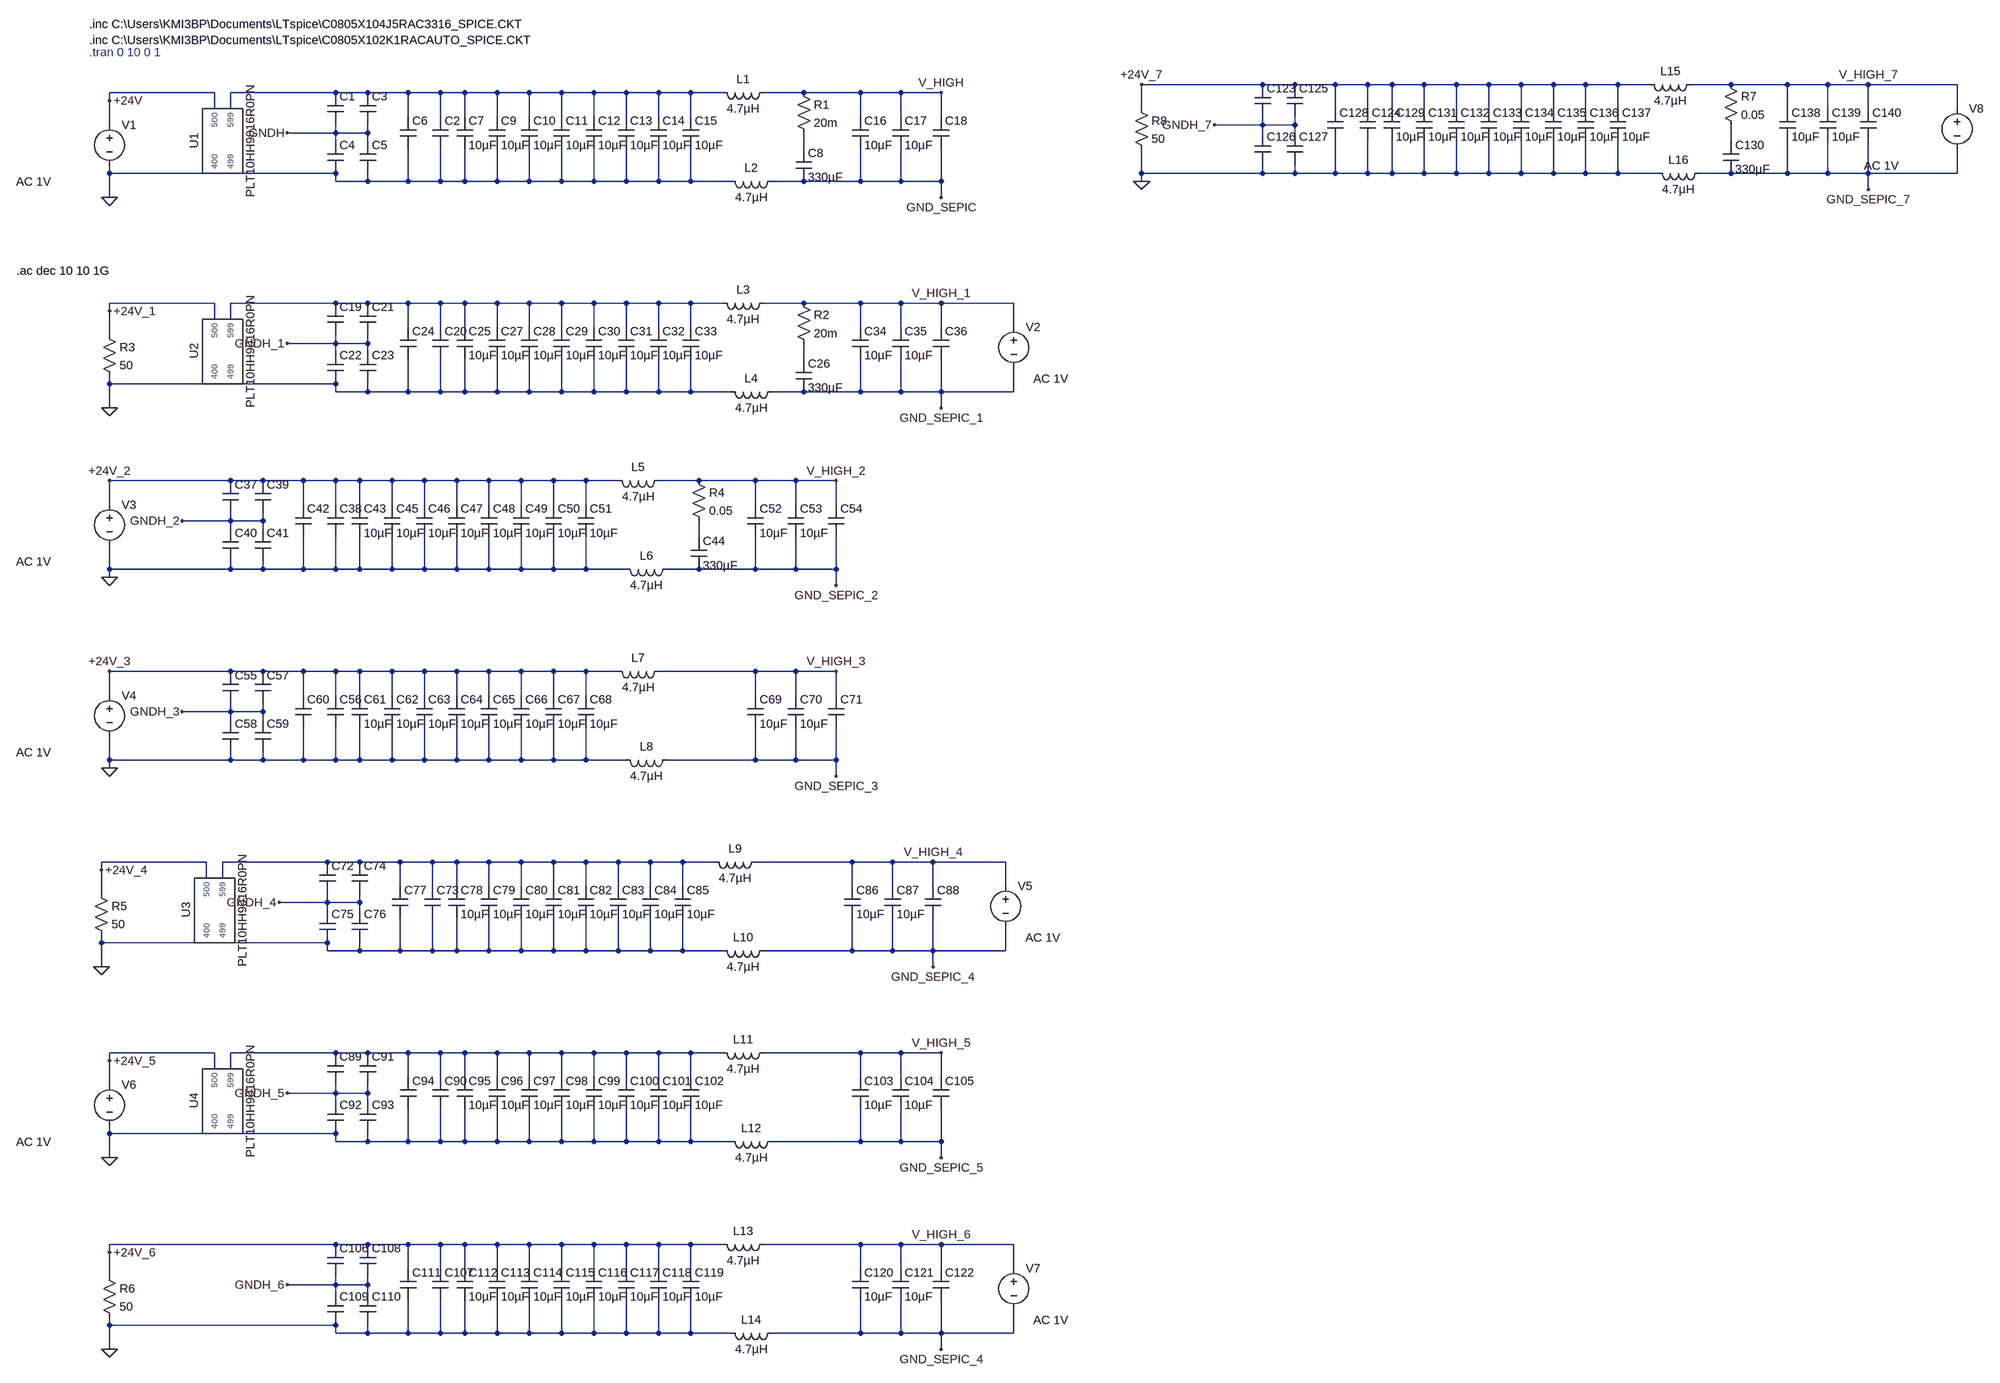
[diagram p0: schematic Draft4.asc]
Draft4.asc, the LTspice schematic file:
Version 4
SHEET 1 2840 2916
WIRE 1408 -64 1168 -64
WIRE 1472 -64 1408 -64
WIRE 1552 -64 1472 -64
WIRE 1616 -64 1552 -64
WIRE 1664 -64 1616 -64
WIRE 1728 -64 1664 -64
WIRE 1792 -64 1728 -64
WIRE 1856 -64 1792 -64
WIRE 1920 -64 1856 -64
WIRE 1984 -64 1920 -64
WIRE 2048 -64 1984 -64
WIRE 2112 -64 2048 -64
WIRE 2176 -64 2112 -64
WIRE 2336 -64 2256 -64
WIRE 2448 -64 2336 -64
WIRE 2528 -64 2448 -64
WIRE 2608 -64 2528 -64
WIRE 2784 -64 2608 -64
WIRE -976 -48 -1184 -48
WIRE -736 -48 -944 -48
WIRE -672 -48 -736 -48
WIRE -592 -48 -672 -48
WIRE -528 -48 -592 -48
WIRE -480 -48 -528 -48
WIRE -416 -48 -480 -48
WIRE -352 -48 -416 -48
WIRE -288 -48 -352 -48
WIRE -224 -48 -288 -48
WIRE -160 -48 -224 -48
WIRE -96 -48 -160 -48
WIRE -32 -48 -96 -48
WIRE 32 -48 -32 -48
WIRE 192 -48 112 -48
WIRE 304 -48 192 -48
WIRE 384 -48 304 -48
WIRE 464 -48 384 -48
WIRE -1184 -32 -1184 -48
WIRE -976 -16 -976 -48
WIRE -944 -16 -944 -48
WIRE 1168 -16 1168 -64
WIRE 1552 -16 1552 -64
WIRE 1616 -16 1616 -64
WIRE 1664 -16 1664 -64
WIRE 1728 -16 1728 -64
WIRE 1792 -16 1792 -64
WIRE 1856 -16 1856 -64
WIRE 1920 -16 1920 -64
WIRE 1984 -16 1984 -64
WIRE 2048 -16 2048 -64
WIRE 2112 -16 2112 -64
WIRE 2448 -16 2448 -64
WIRE 2528 -16 2528 -64
WIRE 2608 -16 2608 -64
WIRE 2784 -16 2784 -64
WIRE -592 0 -592 -48
WIRE -528 0 -528 -48
WIRE -480 0 -480 -48
WIRE -416 0 -416 -48
WIRE -352 0 -352 -48
WIRE -288 0 -288 -48
WIRE -224 0 -224 -48
WIRE -160 0 -160 -48
WIRE -96 0 -96 -48
WIRE -32 0 -32 -48
WIRE 304 0 304 -48
WIRE 384 0 384 -48
WIRE 464 0 464 -48
WIRE -1184 16 -1184 -32
WIRE 1408 16 1408 0
WIRE 1408 16 1312 16
WIRE 1472 16 1472 0
WIRE 1472 16 1408 16
WIRE -736 32 -736 16
WIRE -736 32 -832 32
WIRE -672 32 -672 16
WIRE -672 32 -736 32
WIRE 1408 32 1408 16
WIRE 1472 32 1472 16
WIRE -736 48 -736 32
WIRE -672 48 -672 32
WIRE 2336 48 2336 16
WIRE 192 64 192 32
WIRE -1184 112 -1184 96
WIRE -976 112 -1184 112
WIRE -736 112 -944 112
WIRE 1168 112 1168 64
WIRE 1408 112 1408 96
WIRE 1408 112 1168 112
WIRE 1472 112 1472 96
WIRE 1472 112 1408 112
WIRE 1552 112 1552 48
WIRE 1552 112 1472 112
WIRE 1616 112 1616 48
WIRE 1616 112 1552 112
WIRE 1664 112 1664 48
WIRE 1664 112 1616 112
WIRE 1728 112 1728 48
WIRE 1728 112 1664 112
WIRE 1792 112 1792 48
WIRE 1792 112 1728 112
WIRE 1856 112 1856 48
WIRE 1856 112 1792 112
WIRE 1920 112 1920 48
WIRE 1920 112 1856 112
WIRE 1984 112 1984 48
WIRE 1984 112 1920 112
WIRE 2048 112 2048 48
WIRE 2048 112 1984 112
WIRE 2112 112 2112 48
WIRE 2112 112 2048 112
WIRE 2192 112 2112 112
WIRE 2336 112 2272 112
WIRE 2448 112 2448 48
WIRE 2448 112 2336 112
WIRE 2528 112 2528 48
WIRE 2528 112 2448 112
WIRE 2608 112 2608 48
WIRE 2608 112 2528 112
WIRE 2784 112 2784 64
WIRE 2784 112 2608 112
WIRE -736 128 -736 112
WIRE -672 128 -672 112
WIRE -672 128 -736 128
WIRE -592 128 -592 64
WIRE -592 128 -672 128
WIRE -528 128 -528 64
WIRE -528 128 -592 128
WIRE -480 128 -480 64
WIRE -480 128 -528 128
WIRE -416 128 -416 64
WIRE -416 128 -480 128
WIRE -352 128 -352 64
WIRE -352 128 -416 128
WIRE -288 128 -288 64
WIRE -288 128 -352 128
WIRE -224 128 -224 64
WIRE -224 128 -288 128
WIRE -160 128 -160 64
WIRE -160 128 -224 128
WIRE -96 128 -96 64
WIRE -96 128 -160 128
WIRE -32 128 -32 64
WIRE -32 128 -96 128
WIRE 48 128 -32 128
WIRE 192 128 128 128
WIRE 304 128 304 64
WIRE 304 128 192 128
WIRE 384 128 384 64
WIRE 384 128 304 128
WIRE 464 128 464 64
WIRE 464 128 384 128
WIRE 1168 128 1168 112
WIRE 2608 144 2608 112
WIRE -1184 160 -1184 112
WIRE 464 160 464 128
WIRE -976 416 -1184 416
WIRE -736 416 -944 416
WIRE -672 416 -736 416
WIRE -592 416 -672 416
WIRE -528 416 -592 416
WIRE -480 416 -528 416
WIRE -416 416 -480 416
WIRE -352 416 -416 416
WIRE -288 416 -352 416
WIRE -224 416 -288 416
WIRE -160 416 -224 416
WIRE -96 416 -160 416
WIRE -32 416 -96 416
WIRE 32 416 -32 416
WIRE 192 416 112 416
WIRE 304 416 192 416
WIRE 384 416 304 416
WIRE 464 416 384 416
WIRE 608 416 464 416
WIRE -1184 432 -1184 416
WIRE -976 448 -976 416
WIRE -944 448 -944 416
WIRE -592 464 -592 416
WIRE -528 464 -528 416
WIRE -480 464 -480 416
WIRE -416 464 -416 416
WIRE -352 464 -352 416
WIRE -288 464 -288 416
WIRE -224 464 -224 416
WIRE -160 464 -160 416
WIRE -96 464 -96 416
WIRE -32 464 -32 416
WIRE 304 464 304 416
WIRE 384 464 384 416
WIRE 464 464 464 416
WIRE 608 464 608 416
WIRE -1184 480 -1184 432
WIRE -736 496 -736 480
WIRE -736 496 -832 496
WIRE -672 496 -672 480
WIRE -672 496 -736 496
WIRE -736 512 -736 496
WIRE -672 512 -672 496
WIRE 192 528 192 496
WIRE -1184 576 -1184 560
WIRE -976 576 -1184 576
WIRE -736 576 -944 576
WIRE -736 592 -736 576
WIRE -672 592 -672 576
WIRE -672 592 -736 592
WIRE -592 592 -592 528
WIRE -592 592 -672 592
WIRE -528 592 -528 528
WIRE -528 592 -592 592
WIRE -480 592 -480 528
WIRE -480 592 -528 592
WIRE -416 592 -416 528
WIRE -416 592 -480 592
WIRE -352 592 -352 528
WIRE -352 592 -416 592
WIRE -288 592 -288 528
WIRE -288 592 -352 592
WIRE -224 592 -224 528
WIRE -224 592 -288 592
WIRE -160 592 -160 528
WIRE -160 592 -224 592
WIRE -96 592 -96 528
WIRE -96 592 -160 592
WIRE -32 592 -32 528
WIRE -32 592 -96 592
WIRE 48 592 -32 592
WIRE 192 592 128 592
WIRE 304 592 304 528
WIRE 304 592 192 592
WIRE 384 592 384 528
WIRE 384 592 304 592
WIRE 464 592 464 528
WIRE 464 592 384 592
WIRE 608 592 608 544
WIRE 608 592 464 592
WIRE -1184 624 -1184 576
WIRE 464 624 464 592
WIRE -944 768 -1184 768
WIRE -880 768 -944 768
WIRE -800 768 -880 768
WIRE -736 768 -800 768
WIRE -688 768 -736 768
WIRE -624 768 -688 768
WIRE -560 768 -624 768
WIRE -496 768 -560 768
WIRE -432 768 -496 768
WIRE -368 768 -432 768
WIRE -304 768 -368 768
WIRE -240 768 -304 768
WIRE -176 768 -240 768
WIRE -16 768 -96 768
WIRE 96 768 -16 768
WIRE 176 768 96 768
WIRE 256 768 176 768
WIRE -1184 816 -1184 768
WIRE -800 816 -800 768
WIRE -736 816 -736 768
WIRE -688 816 -688 768
WIRE -624 816 -624 768
WIRE -560 816 -560 768
WIRE -496 816 -496 768
WIRE -432 816 -432 768
WIRE -368 816 -368 768
WIRE -304 816 -304 768
WIRE -240 816 -240 768
WIRE 96 816 96 768
WIRE 176 816 176 768
WIRE 256 816 256 768
WIRE -944 848 -944 832
WIRE -944 848 -1040 848
WIRE -880 848 -880 832
WIRE -880 848 -944 848
WIRE -944 864 -944 848
WIRE -880 864 -880 848
WIRE -16 880 -16 848
WIRE -1184 944 -1184 896
WIRE -944 944 -944 928
WIRE -944 944 -1184 944
WIRE -880 944 -880 928
WIRE -880 944 -944 944
WIRE -800 944 -800 880
WIRE -800 944 -880 944
WIRE -736 944 -736 880
WIRE -736 944 -800 944
WIRE -688 944 -688 880
WIRE -688 944 -736 944
WIRE -624 944 -624 880
WIRE -624 944 -688 944
WIRE -560 944 -560 880
WIRE -560 944 -624 944
WIRE -496 944 -496 880
WIRE -496 944 -560 944
WIRE -432 944 -432 880
WIRE -432 944 -496 944
WIRE -368 944 -368 880
WIRE -368 944 -432 944
WIRE -304 944 -304 880
WIRE -304 944 -368 944
WIRE -240 944 -240 880
WIRE -240 944 -304 944
WIRE -160 944 -240 944
WIRE -16 944 -80 944
WIRE 96 944 96 880
WIRE 96 944 -16 944
WIRE 176 944 176 880
WIRE 176 944 96 944
WIRE 256 944 256 880
WIRE 256 944 176 944
WIRE -1184 960 -1184 944
WIRE 256 976 256 944
WIRE -944 1168 -1184 1168
WIRE -880 1168 -944 1168
WIRE -800 1168 -880 1168
WIRE -736 1168 -800 1168
WIRE -688 1168 -736 1168
WIRE -624 1168 -688 1168
WIRE -560 1168 -624 1168
WIRE -496 1168 -560 1168
WIRE -432 1168 -496 1168
WIRE -368 1168 -432 1168
WIRE -304 1168 -368 1168
WIRE -240 1168 -304 1168
WIRE -176 1168 -240 1168
WIRE 96 1168 -96 1168
WIRE 176 1168 96 1168
WIRE 256 1168 176 1168
WIRE -1184 1216 -1184 1168
WIRE -800 1216 -800 1168
WIRE -736 1216 -736 1168
WIRE -688 1216 -688 1168
WIRE -624 1216 -624 1168
WIRE -560 1216 -560 1168
WIRE -496 1216 -496 1168
WIRE -432 1216 -432 1168
WIRE -368 1216 -368 1168
WIRE -304 1216 -304 1168
WIRE -240 1216 -240 1168
WIRE 96 1216 96 1168
WIRE 176 1216 176 1168
WIRE 256 1216 256 1168
WIRE -944 1248 -944 1232
WIRE -944 1248 -1040 1248
WIRE -880 1248 -880 1232
WIRE -880 1248 -944 1248
WIRE -944 1264 -944 1248
WIRE -880 1264 -880 1248
WIRE -1184 1344 -1184 1296
WIRE -944 1344 -944 1328
WIRE -944 1344 -1184 1344
WIRE -880 1344 -880 1328
WIRE -880 1344 -944 1344
WIRE -800 1344 -800 1280
WIRE -800 1344 -880 1344
WIRE -736 1344 -736 1280
WIRE -736 1344 -800 1344
WIRE -688 1344 -688 1280
WIRE -688 1344 -736 1344
WIRE -624 1344 -624 1280
WIRE -624 1344 -688 1344
WIRE -560 1344 -560 1280
WIRE -560 1344 -624 1344
WIRE -496 1344 -496 1280
WIRE -496 1344 -560 1344
WIRE -432 1344 -432 1280
WIRE -432 1344 -496 1344
WIRE -368 1344 -368 1280
WIRE -368 1344 -432 1344
WIRE -304 1344 -304 1280
WIRE -304 1344 -368 1344
WIRE -240 1344 -240 1280
WIRE -240 1344 -304 1344
WIRE -160 1344 -240 1344
WIRE 96 1344 96 1280
WIRE 96 1344 -80 1344
WIRE 176 1344 176 1280
WIRE 176 1344 96 1344
WIRE 256 1344 256 1280
WIRE 256 1344 176 1344
WIRE -1184 1360 -1184 1344
WIRE 256 1376 256 1344
WIRE -992 1616 -1200 1616
WIRE -752 1616 -960 1616
WIRE -688 1616 -752 1616
WIRE -608 1616 -688 1616
WIRE -544 1616 -608 1616
WIRE -496 1616 -544 1616
WIRE -432 1616 -496 1616
WIRE -368 1616 -432 1616
WIRE -304 1616 -368 1616
WIRE -240 1616 -304 1616
WIRE -176 1616 -240 1616
WIRE -112 1616 -176 1616
WIRE -48 1616 -112 1616
WIRE 16 1616 -48 1616
WIRE 288 1616 96 1616
WIRE 368 1616 288 1616
WIRE 448 1616 368 1616
WIRE 592 1616 448 1616
WIRE -1200 1632 -1200 1616
WIRE -992 1648 -992 1616
WIRE -960 1648 -960 1616
WIRE -608 1664 -608 1616
WIRE -544 1664 -544 1616
WIRE -496 1664 -496 1616
WIRE -432 1664 -432 1616
WIRE -368 1664 -368 1616
WIRE -304 1664 -304 1616
WIRE -240 1664 -240 1616
WIRE -176 1664 -176 1616
WIRE -112 1664 -112 1616
WIRE -48 1664 -48 1616
WIRE 288 1664 288 1616
WIRE 368 1664 368 1616
WIRE 448 1664 448 1616
WIRE 592 1664 592 1616
WIRE -1200 1680 -1200 1632
WIRE -752 1696 -752 1680
WIRE -752 1696 -848 1696
WIRE -688 1696 -688 1680
WIRE -688 1696 -752 1696
WIRE -752 1712 -752 1696
WIRE -688 1712 -688 1696
WIRE -1200 1776 -1200 1760
WIRE -992 1776 -1200 1776
WIRE -752 1776 -960 1776
WIRE -752 1792 -752 1776
WIRE -688 1792 -688 1776
WIRE -688 1792 -752 1792
WIRE -608 1792 -608 1728
WIRE -608 1792 -688 1792
WIRE -544 1792 -544 1728
WIRE -544 1792 -608 1792
WIRE -496 1792 -496 1728
WIRE -496 1792 -544 1792
WIRE -432 1792 -432 1728
WIRE -432 1792 -496 1792
WIRE -368 1792 -368 1728
WIRE -368 1792 -432 1792
WIRE -304 1792 -304 1728
WIRE -304 1792 -368 1792
WIRE -240 1792 -240 1728
WIRE -240 1792 -304 1792
WIRE -176 1792 -176 1728
WIRE -176 1792 -240 1792
WIRE -112 1792 -112 1728
WIRE -112 1792 -176 1792
WIRE -48 1792 -48 1728
WIRE -48 1792 -112 1792
WIRE 32 1792 -48 1792
WIRE 288 1792 288 1728
WIRE 288 1792 112 1792
WIRE 368 1792 368 1728
WIRE 368 1792 288 1792
WIRE 448 1792 448 1728
WIRE 448 1792 368 1792
WIRE 592 1792 592 1744
WIRE 592 1792 448 1792
WIRE -1200 1824 -1200 1776
WIRE 448 1824 448 1792
WIRE -976 2016 -1184 2016
WIRE -736 2016 -944 2016
WIRE -672 2016 -736 2016
WIRE -592 2016 -672 2016
WIRE -528 2016 -592 2016
WIRE -480 2016 -528 2016
WIRE -416 2016 -480 2016
WIRE -352 2016 -416 2016
WIRE -288 2016 -352 2016
WIRE -224 2016 -288 2016
WIRE -160 2016 -224 2016
WIRE -96 2016 -160 2016
WIRE -32 2016 -96 2016
WIRE 32 2016 -32 2016
WIRE 304 2016 112 2016
WIRE 384 2016 304 2016
WIRE 464 2016 384 2016
WIRE -1184 2032 -1184 2016
WIRE -976 2048 -976 2016
WIRE -944 2048 -944 2016
WIRE -592 2064 -592 2016
WIRE -528 2064 -528 2016
WIRE -480 2064 -480 2016
WIRE -416 2064 -416 2016
WIRE -352 2064 -352 2016
WIRE -288 2064 -288 2016
WIRE -224 2064 -224 2016
WIRE -160 2064 -160 2016
WIRE -96 2064 -96 2016
WIRE -32 2064 -32 2016
WIRE 304 2064 304 2016
WIRE 384 2064 384 2016
WIRE 464 2064 464 2016
WIRE -1184 2080 -1184 2032
WIRE -736 2096 -736 2080
WIRE -736 2096 -832 2096
WIRE -672 2096 -672 2080
WIRE -672 2096 -736 2096
WIRE -736 2112 -736 2096
WIRE -672 2112 -672 2096
WIRE -1184 2176 -1184 2160
WIRE -976 2176 -1184 2176
WIRE -736 2176 -944 2176
WIRE -736 2192 -736 2176
WIRE -672 2192 -672 2176
WIRE -672 2192 -736 2192
WIRE -592 2192 -592 2128
WIRE -592 2192 -672 2192
WIRE -528 2192 -528 2128
WIRE -528 2192 -592 2192
WIRE -480 2192 -480 2128
WIRE -480 2192 -528 2192
WIRE -416 2192 -416 2128
WIRE -416 2192 -480 2192
WIRE -352 2192 -352 2128
WIRE -352 2192 -416 2192
WIRE -288 2192 -288 2128
WIRE -288 2192 -352 2192
WIRE -224 2192 -224 2128
WIRE -224 2192 -288 2192
WIRE -160 2192 -160 2128
WIRE -160 2192 -224 2192
WIRE -96 2192 -96 2128
WIRE -96 2192 -160 2192
WIRE -32 2192 -32 2128
WIRE -32 2192 -96 2192
WIRE 48 2192 -32 2192
WIRE 304 2192 304 2128
WIRE 304 2192 128 2192
WIRE 384 2192 384 2128
WIRE 384 2192 304 2192
WIRE 464 2192 464 2128
WIRE 464 2192 384 2192
WIRE -1184 2224 -1184 2176
WIRE 464 2224 464 2192
WIRE -736 2496 -1184 2496
WIRE -672 2496 -736 2496
WIRE -592 2496 -672 2496
WIRE -528 2496 -592 2496
WIRE -480 2496 -528 2496
WIRE -416 2496 -480 2496
WIRE -352 2496 -416 2496
WIRE -288 2496 -352 2496
WIRE -224 2496 -288 2496
WIRE -160 2496 -224 2496
WIRE -96 2496 -160 2496
WIRE -32 2496 -96 2496
WIRE 32 2496 -32 2496
WIRE 304 2496 112 2496
WIRE 384 2496 304 2496
WIRE 464 2496 384 2496
WIRE 608 2496 464 2496
WIRE -1184 2512 -1184 2496
WIRE -592 2544 -592 2496
WIRE -528 2544 -528 2496
WIRE -480 2544 -480 2496
WIRE -416 2544 -416 2496
WIRE -352 2544 -352 2496
WIRE -288 2544 -288 2496
WIRE -224 2544 -224 2496
WIRE -160 2544 -160 2496
WIRE -96 2544 -96 2496
WIRE -32 2544 -32 2496
WIRE 304 2544 304 2496
WIRE 384 2544 384 2496
WIRE 464 2544 464 2496
WIRE 608 2544 608 2496
WIRE -1184 2560 -1184 2512
WIRE -736 2576 -736 2560
WIRE -736 2576 -832 2576
WIRE -672 2576 -672 2560
WIRE -672 2576 -736 2576
WIRE -736 2592 -736 2576
WIRE -672 2592 -672 2576
WIRE -1184 2656 -1184 2640
WIRE -736 2656 -1184 2656
WIRE -736 2672 -736 2656
WIRE -672 2672 -672 2656
WIRE -672 2672 -736 2672
WIRE -592 2672 -592 2608
WIRE -592 2672 -672 2672
WIRE -528 2672 -528 2608
WIRE -528 2672 -592 2672
WIRE -480 2672 -480 2608
WIRE -480 2672 -528 2672
WIRE -416 2672 -416 2608
WIRE -416 2672 -480 2672
WIRE -352 2672 -352 2608
WIRE -352 2672 -416 2672
WIRE -288 2672 -288 2608
WIRE -288 2672 -352 2672
WIRE -224 2672 -224 2608
WIRE -224 2672 -288 2672
WIRE -160 2672 -160 2608
WIRE -160 2672 -224 2672
WIRE -96 2672 -96 2608
WIRE -96 2672 -160 2672
WIRE -32 2672 -32 2608
WIRE -32 2672 -96 2672
WIRE 48 2672 -32 2672
WIRE 304 2672 304 2608
WIRE 304 2672 128 2672
WIRE 384 2672 384 2608
WIRE 384 2672 304 2672
WIRE 464 2672 464 2608
WIRE 464 2672 384 2672
WIRE 608 2672 608 2624
WIRE 608 2672 464 2672
WIRE -1184 2704 -1184 2656
WIRE 464 2704 464 2672
FLAG -1184 160 0
FLAG -1184 -32 +24V
FLAG -832 32 GNDH
FLAG 464 160 GND_SEPIC
FLAG 464 -48 V_HIGH
FLAG -1184 624 0
FLAG -1184 432 +24V_1
FLAG -832 496 GNDH_1
FLAG 464 624 GND_SEPIC_1
FLAG 464 416 V_HIGH_1
FLAG -1040 848 GNDH_2
FLAG -1184 960 0
FLAG 256 976 GND_SEPIC_2
FLAG 256 768 V_HIGH_2
FLAG -1184 768 +24V_2
FLAG -1040 1248 GNDH_3
FLAG -1184 1360 0
FLAG 256 1376 GND_SEPIC_3
FLAG 256 1168 V_HIGH_3
FLAG -1184 1168 +24V_3
FLAG -1200 1824 0
FLAG -1200 1632 +24V_4
FLAG -848 1696 GNDH_4
FLAG 448 1824 GND_SEPIC_4
FLAG 448 1616 V_HIGH_4
FLAG -1184 2224 0
FLAG -1184 2032 +24V_5
FLAG -832 2096 GNDH_5
FLAG 464 2224 GND_SEPIC_5
FLAG 464 2016 V_HIGH_5
FLAG -1184 2704 0
FLAG -1184 2512 +24V_6
FLAG -832 2576 GNDH_6
FLAG 464 2704 GND_SEPIC_4
FLAG 464 2496 V_HIGH_6
FLAG 1312 16 GNDH_7
FLAG 1168 128 0
FLAG 2608 144 GND_SEPIC_7
FLAG 2608 -64 V_HIGH_7
FLAG 1168 -64 +24V_7
SYMBOL PLT10HH9016R0PN -960 48 R270
SYMATTR InstName U1
SYMBOL voltage -1184 0 R0
WINDOW 3 -185 101 Left 2
WINDOW 123 -185 129 Left 2
WINDOW 39 0 0 Left 0
SYMATTR Value ""
SYMATTR Value2 AC 1V
SYMATTR InstName V1
SYMBOL cap -752 -48 R0
WINDOW 3 24 56 Invisible 2
SYMATTR Value C0805X102K1RACAUTO
SYMATTR InstName C1
SYMATTR Prefix X
SYMBOL cap -544 0 R0
WINDOW 3 24 56 Invisible 2
SYMATTR Value C0805X104J5RAC3316
SYMATTR InstName C2
SYMATTR Prefix X
SYMBOL cap -688 -48 R0
WINDOW 3 24 56 Invisible 2
SYMATTR Value C0805X102K1RACAUTO
SYMATTR InstName C3
SYMATTR Prefix X
SYMBOL cap -752 48 R0
WINDOW 3 24 56 Invisible 2
SYMATTR Value C0805X102K1RACAUTO
SYMATTR InstName C4
SYMATTR Prefix X
SYMBOL cap -688 48 R0
WINDOW 3 24 56 Invisible 2
SYMATTR Value C0805X102K1RACAUTO
SYMATTR InstName C5
SYMATTR Prefix X
SYMBOL cap -608 0 R0
WINDOW 3 24 56 Invisible 2
SYMATTR Value C0805X102K1RACAUTO
SYMATTR InstName C6
SYMATTR Prefix X
SYMBOL cap -496 0 R0
SYMATTR InstName C7
SYMATTR Value 10µF
SYMATTR SpiceLine V=50 Rser=2.2m Lser=0.6n Rpar=0.05G
SYMBOL ind 128 -64 R90
WINDOW 0 5 56 VBottom 2
WINDOW 3 32 56 VTop 2
SYMATTR InstName L1
SYMATTR Value 4.7µH
SYMATTR SpiceLine Rser=0.023 Rpar=6.2 Cpar=2.12pF
SYMBOL res 176 -64 R0
SYMATTR InstName R1
SYMATTR Value 20m
SYMATTR SpiceLine tol=1 pwr=125m
SYMBOL cap 176 64 R0
SYMATTR InstName C8
SYMATTR Value 330µF
SYMATTR SpiceLine V=50 Irms=600m Rser=230m
SYMBOL cap -432 0 R0
SYMATTR InstName C9
SYMATTR Value 10µF
SYMATTR SpiceLine V=50 Rser=2.2m Lser=0.6n Rpar=0.05G
SYMBOL cap -368 0 R0
SYMATTR InstName C10
SYMATTR Value 10µF
SYMATTR SpiceLine V=50 Rser=2.2m Lser=0.6n Rpar=0.05G
SYMBOL cap -304 0 R0
SYMATTR InstName C11
SYMATTR Value 10µF
SYMATTR SpiceLine V=50 Rser=2.2m Lser=0.6n Rpar=0.05G
SYMBOL cap -240 0 R0
SYMATTR InstName C12
SYMATTR Value 10µF
SYMATTR SpiceLine V=50 Rser=2.2m Lser=0.6n Rpar=0.05G
SYMBOL cap -176 0 R0
SYMATTR InstName C13
SYMATTR Value 10µF
SYMATTR SpiceLine V=50 Rser=2.2m Lser=0.6n Rpar=0.05G
SYMBOL cap -112 0 R0
SYMATTR InstName C14
SYMATTR Value 10µF
SYMATTR SpiceLine V=50 Rser=2.2m Lser=0.6n Rpar=0.05G
SYMBOL cap -48 0 R0
SYMATTR InstName C15
SYMATTR Value 10µF
SYMATTR SpiceLine V=50 Rser=2.2m Lser=0.6n Rpar=0.05G
SYMBOL ind 144 112 R90
WINDOW 0 5 56 VBottom 2
WINDOW 3 32 56 VTop 2
SYMATTR InstName L2
SYMATTR Value 4.7µH
SYMATTR SpiceLine Rser=0.023 Rpar=6.2 Cpar=2.12pF
SYMBOL cap 288 0 R0
SYMATTR InstName C16
SYMATTR Value 10µF
SYMATTR SpiceLine V=50 Rser=2.2m Lser=0.6n Rpar=0.05G
SYMBOL cap 368 0 R0
SYMATTR InstName C17
SYMATTR Value 10µF
SYMATTR SpiceLine V=50 Rser=2.2m Lser=0.6n Rpar=0.05G
SYMBOL cap 448 0 R0
WINDOW 3 24 56 Invisible 2
SYMATTR Value C0805X104J5RAC3316
SYMATTR InstName C18
SYMATTR Prefix X
SYMBOL PLT10HH9016R0PN -960 512 R270
SYMATTR InstName U2
SYMBOL voltage 608 448 R0
WINDOW 3 -185 101 Left 2
WINDOW 123 39 118 Left 2
WINDOW 39 0 0 Left 0
SYMATTR Value ""
SYMATTR Value2 AC 1V
SYMATTR InstName V2
SYMBOL cap -752 416 R0
WINDOW 3 24 56 Invisible 2
SYMATTR Value C0805X102K1RACAUTO
SYMATTR InstName C19
SYMATTR Prefix X
SYMBOL cap -544 464 R0
WINDOW 3 24 56 Invisible 2
SYMATTR Value C0805X104J5RAC3316
SYMATTR InstName C20
SYMATTR Prefix X
SYMBOL cap -688 416 R0
WINDOW 3 24 56 Invisible 2
SYMATTR Value C0805X102K1RACAUTO
SYMATTR InstName C21
SYMATTR Prefix X
SYMBOL cap -752 512 R0
WINDOW 3 24 56 Invisible 2
SYMATTR Value C0805X102K1RACAUTO
SYMATTR InstName C22
SYMATTR Prefix X
SYMBOL cap -688 512 R0
WINDOW 3 24 56 Invisible 2
SYMATTR Value C0805X102K1RACAUTO
SYMATTR InstName C23
SYMATTR Prefix X
SYMBOL cap -608 464 R0
WINDOW 3 24 56 Invisible 2
SYMATTR Value C0805X102K1RACAUTO
SYMATTR InstName C24
SYMATTR Prefix X
SYMBOL cap -496 464 R0
SYMATTR InstName C25
SYMATTR Value 10µF
SYMATTR SpiceLine V=50 Rser=2.2m Lser=0.6n Rpar=0.05G
SYMBOL ind 128 400 R90
WINDOW 0 5 56 VBottom 2
WINDOW 3 32 56 VTop 2
SYMATTR InstName L3
SYMATTR Value 4.7µH
SYMATTR SpiceLine Rser=0.023 Rpar=6.2 Cpar=2.12pF
SYMBOL res 176 400 R0
SYMATTR InstName R2
SYMATTR Value 20m
SYMATTR SpiceLine tol=1 pwr=125m
SYMBOL cap 176 528 R0
SYMATTR InstName C26
SYMATTR Value 330µF
SYMATTR SpiceLine V=50 Irms=600m Rser=230m
SYMBOL cap -432 464 R0
SYMATTR InstName C27
SYMATTR Value 10µF
SYMATTR SpiceLine V=50 Rser=2.2m Lser=0.6n Rpar=0.05G
SYMBOL cap -368 464 R0
SYMATTR InstName C28
SYMATTR Value 10µF
SYMATTR SpiceLine V=50 Rser=2.2m Lser=0.6n Rpar=0.05G
SYMBOL cap -304 464 R0
SYMATTR InstName C29
SYMATTR Value 10µF
SYMATTR SpiceLine V=50 Rser=2.2m Lser=0.6n Rpar=0.05G
SYMBOL cap -240 464 R0
SYMATTR InstName C30
SYMATTR Value 10µF
SYMATTR SpiceLine V=50 Rser=2.2m Lser=0.6n Rpar=0.05G
SYMBOL cap -176 464 R0
SYMATTR InstName C31
SYMATTR Value 10µF
SYMATTR SpiceLine V=50 Rser=2.2m Lser=0.6n Rpar=0.05G
SYMBOL cap -112 464 R0
SYMATTR InstName C32
SYMATTR Value 10µF
SYMATTR SpiceLine V=50 Rser=2.2m Lser=0.6n Rpar=0.05G
SYMBOL cap -48 464 R0
SYMATTR InstName C33
SYMATTR Value 10µF
SYMATTR SpiceLine V=50 Rser=2.2m Lser=0.6n Rpar=0.05G
SYMBOL ind 144 576 R90
WINDOW 0 5 56 VBottom 2
WINDOW 3 32 56 VTop 2
SYMATTR InstName L4
SYMATTR Value 4.7µH
SYMATTR SpiceLine Rser=0.023 Rpar=6.2 Cpar=2.12pF
SYMBOL cap 288 464 R0
SYMATTR InstName C34
SYMATTR Value 10µF
SYMATTR SpiceLine V=50 Rser=2.2m Lser=0.6n Rpar=0.05G
SYMBOL cap 368 464 R0
SYMATTR InstName C35
SYMATTR Value 10µF
SYMATTR SpiceLine V=50 Rser=2.2m Lser=0.6n Rpar=0.05G
SYMBOL cap 448 464 R0
WINDOW 3 24 56 Invisible 2
SYMATTR Value C0805X104J5RAC3316
SYMATTR InstName C36
SYMATTR Prefix X
SYMBOL res -1200 464 R0
SYMATTR InstName R3
SYMATTR Value 50
SYMBOL voltage -1184 800 R0
WINDOW 3 -185 101 Left 2
WINDOW 123 -185 129 Left 2
WINDOW 39 0 0 Left 0
SYMATTR Value ""
SYMATTR Value2 AC 1V
SYMATTR InstName V3
SYMBOL cap -960 768 R0
WINDOW 3 24 56 Invisible 2
SYMATTR Value C0805X102K1RACAUTO
SYMATTR InstName C37
SYMATTR Prefix X
SYMBOL cap -752 816 R0
WINDOW 3 24 56 Invisible 2
SYMATTR Value C0805X104J5RAC3316
SYMATTR InstName C38
SYMATTR Prefix X
SYMBOL cap -896 768 R0
WINDOW 3 24 56 Invisible 2
SYMATTR Value C0805X102K1RACAUTO
SYMATTR InstName C39
SYMATTR Prefix X
SYMBOL cap -960 864 R0
WINDOW 3 24 56 Invisible 2
SYMATTR Value C0805X102K1RACAUTO
SYMATTR InstName C40
SYMATTR Prefix X
SYMBOL cap -896 864 R0
WINDOW 3 24 56 Invisible 2
SYMATTR Value C0805X102K1RACAUTO
SYMATTR InstName C41
SYMATTR Prefix X
SYMBOL cap -816 816 R0
WINDOW 3 24 56 Invisible 2
SYMATTR Value C0805X102K1RACAUTO
SYMATTR InstName C42
SYMATTR Prefix X
SYMBOL cap -704 816 R0
SYMATTR InstName C43
SYMATTR Value 10µF
SYMATTR SpiceLine V=50 Rser=2.2m Lser=0.6n Rpar=0.05G
SYMBOL ind -80 752 R90
WINDOW 0 5 56 VBottom 2
WINDOW 3 32 56 VTop 2
SYMATTR InstName L5
SYMATTR Value 4.7µH
SYMATTR SpiceLine Rser=0.023 Rpar=6.2 Cpar=2.12pF
SYMBOL res -32 752 R0
SYMATTR InstName R4
SYMATTR Value 0.05
SYMATTR SpiceLine tol=1 pwr=125m
SYMBOL cap -32 880 R0
SYMATTR InstName C44
SYMATTR Value 330µF
SYMATTR SpiceLine V=50 Irms=600m Rser=230m
SYMBOL cap -640 816 R0
SYMATTR InstName C45
SYMATTR Value 10µF
SYMATTR SpiceLine V=50 Rser=2.2m Lser=0.6n Rpar=0.05G
SYMBOL cap -576 816 R0
SYMATTR InstName C46
SYMATTR Value 10µF
SYMATTR SpiceLine V=50 Rser=2.2m Lser=0.6n Rpar=0.05G
SYMBOL cap -512 816 R0
SYMATTR InstName C47
SYMATTR Value 10µF
SYMATTR SpiceLine V=50 Rser=2.2m Lser=0.6n Rpar=0.05G
SYMBOL cap -448 816 R0
SYMATTR InstName C48
SYMATTR Value 10µF
SYMATTR SpiceLine V=50 Rser=2.2m Lser=0.6n Rpar=0.05G
SYMBOL cap -384 816 R0
SYMATTR InstName C49
SYMATTR Value 10µF
SYMATTR SpiceLine V=50 Rser=2.2m Lser=0.6n Rpar=0.05G
SYMBOL cap -320 816 R0
SYMATTR InstName C50
SYMATTR Value 10µF
SYMATTR SpiceLine V=50 Rser=2.2m Lser=0.6n Rpar=0.05G
SYMBOL cap -256 816 R0
SYMATTR InstName C51
SYMATTR Value 10µF
SYMATTR SpiceLine V=50 Rser=2.2m Lser=0.6n Rpar=0.05G
SYMBOL ind -64 928 R90
WINDOW 0 5 56 VBottom 2
WINDOW 3 32 56 VTop 2
SYMATTR InstName L6
SYMATTR Value 4.7µH
SYMATTR SpiceLine Rser=0.023 Rpar=6.2 Cpar=2.12pF
SYMBOL cap 80 816 R0
SYMATTR InstName C52
SYMATTR Value 10µF
SYMATTR SpiceLine V=50 Rser=2.2m Lser=0.6n Rpar=0.05G
SYMBOL cap 160 816 R0
SYMATTR InstName C53
SYMATTR Value 10µF
SYMATTR SpiceLine V=50 Rser=2.2m Lser=0.6n Rpar=0.05G
SYMBOL cap 240 816 R0
WINDOW 3 24 56 Invisible 2
SYMATTR Value C0805X104J5RAC3316
SYMATTR InstName C54
SYMATTR Prefix X
SYMBOL voltage -1184 1200 R0
WINDOW 3 -185 101 Left 2
WINDOW 123 -185 129 Left 2
WINDOW 39 0 0 Left 0
SYMATTR Value ""
SYMATTR Value2 AC 1V
SYMATTR InstName V4
SYMBOL cap -960 1168 R0
WINDOW 3 24 56 Invisible 2
SYMATTR Value C0805X102K1RACAUTO
SYMATTR InstName C55
SYMATTR Prefix X
SYMBOL cap -752 1216 R0
WINDOW 3 24 56 Invisible 2
SYMATTR Value C0805X104J5RAC3316
SYMATTR InstName C56
SYMATTR Prefix X
SYMBOL cap -896 1168 R0
WINDOW 3 24 56 Invisible 2
SYMATTR Value C0805X102K1RACAUTO
SYMATTR InstName C57
SYMATTR Prefix X
SYMBOL cap -960 1264 R0
WINDOW 3 24 56 Invisible 2
SYMATTR Value C0805X102K1RACAUTO
SYMATTR InstName C58
SYMATTR Prefix X
SYMBOL cap -896 1264 R0
WINDOW 3 24 56 Invisible 2
SYMATTR Value C0805X102K1RACAUTO
SYMATTR InstName C59
SYMATTR Prefix X
SYMBOL cap -816 1216 R0
WINDOW 3 24 56 Invisible 2
SYMATTR Value C0805X102K1RACAUTO
SYMATTR InstName C60
SYMATTR Prefix X
SYMBOL cap -704 1216 R0
SYMATTR InstName C61
SYMATTR Value 10µF
SYMATTR SpiceLine V=50 Rser=2.2m Lser=0.6n Rpar=0.05G
SYMBOL ind -80 1152 R90
WINDOW 0 5 56 VBottom 2
WINDOW 3 32 56 VTop 2
SYMATTR InstName L7
SYMATTR Value 4.7µH
SYMATTR SpiceLine Rser=0.023 Rpar=6.2 Cpar=2.12pF
SYMBOL cap -640 1216 R0
SYMATTR InstName C62
SYMATTR Value 10µF
SYMATTR SpiceLine V=50 Rser=2.2m Lser=0.6n Rpar=0.05G
SYMBOL cap -576 1216 R0
SYMATTR InstName C63
SYMATTR Value 10µF
SYMATTR SpiceLine V=50 Rser=2.2m Lser=0.6n Rpar=0.05G
SYMBOL cap -512 1216 R0
SYMATTR InstName C64
SYMATTR Value 10µF
SYMATTR SpiceLine V=50 Rser=2.2m Lser=0.6n Rpar=0.05G
SYMBOL cap -448 1216 R0
SYMATTR InstName C65
SYMATTR Value 10µF
SYMATTR SpiceLine V=50 Rser=2.2m Lser=0.6n Rpar=0.05G
SYMBOL cap -384 1216 R0
SYMATTR InstName C66
SYMATTR Value 10µF
SYMATTR SpiceLine V=50 Rser=2.2m Lser=0.6n Rpar=0.05G
SYMBOL cap -320 1216 R0
SYMATTR InstName C67
SYMATTR Value 10µF
SYMATTR SpiceLine V=50 Rser=2.2m Lser=0.6n Rpar=0.05G
SYMBOL cap -256 1216 R0
SYMATTR InstName C68
SYMATTR Value 10µF
SYMATTR SpiceLine V=50 Rser=2.2m Lser=0.6n Rpar=0.05G
SYMBOL ind -64 1328 R90
WINDOW 0 5 56 VBottom 2
WINDOW 3 32 56 VTop 2
SYMATTR InstName L8
SYMATTR Value 4.7µH
SYMATTR SpiceLine Rser=0.023 Rpar=6.2 Cpar=2.12pF
SYMBOL cap 80 1216 R0
SYMATTR InstName C69
SYMATTR Value 10µF
SYMATTR SpiceLine V=50 Rser=2.2m Lser=0.6n Rpar=0.05G
SYMBOL cap 160 1216 R0
SYMATTR InstName C70
SYMATTR Value 10µF
SYMATTR SpiceLine V=50 Rser=2.2m Lser=0.6n Rpar=0.05G
SYMBOL cap 240 1216 R0
WINDOW 3 24 56 Invisible 2
SYMATTR Value C0805X104J5RAC3316
SYMATTR InstName C71
SYMATTR Prefix X
SYMBOL PLT10HH9016R0PN -976 1712 R270
SYMATTR InstName U3
SYMBOL voltage 592 1648 R0
WINDOW 3 -185 101 Left 2
WINDOW 123 39 118 Left 2
WINDOW 39 0 0 Left 0
SYMATTR Value ""
SYMATTR Value2 AC 1V
SYMATTR InstName V5
SYMBOL cap -768 1616 R0
WINDOW 3 24 56 Invisible 2
SYMATTR Value C0805X102K1RACAUTO
SYMATTR InstName C72
SYMATTR Prefix X
SYMBOL cap -560 1664 R0
WINDOW 3 24 56 Invisible 2
SYMATTR Value C0805X104J5RAC3316
SYMATTR InstName C73
SYMATTR Prefix X
SYMBOL cap -704 1616 R0
WINDOW 3 24 56 Invisible 2
SYMATTR Value C0805X102K1RACAUTO
SYMATTR InstName C74
SYMATTR Prefix X
SYMBOL cap -768 1712 R0
WINDOW 3 24 56 Invisible 2
SYMATTR Value C0805X102K1RACAUTO
SYMATTR InstName C75
SYMATTR Prefix X
SYMBOL cap -704 1712 R0
WINDOW 3 24 56 Invisible 2
SYMATTR Value C0805X102K1RACAUTO
SYMATTR InstName C76
SYMATTR Prefix X
SYMBOL cap -624 1664 R0
WINDOW 3 24 56 Invisible 2
SYMATTR Value C0805X102K1RACAUTO
SYMATTR InstName C77
SYMATTR Prefix X
SYMBOL cap -512 1664 R0
SYMATTR InstName C78
SYMATTR Value 10µF
SYMATTR SpiceLine V=50 Rser=2.2m Lser=0.6n Rpar=0.05G
SYMBOL ind 112 1600 R90
WINDOW 0 5 56 VBottom 2
WINDOW 3 32 56 VTop 2
SYMATTR InstName L9
SYMATTR Value 4.7µH
SYMATTR SpiceLine Rser=0.023 Rpar=6.2 Cpar=2.12pF
SYMBOL cap -448 1664 R0
SYMATTR InstName C79
SYMATTR Value 10µF
SYMATTR SpiceLine V=50 Rser=2.2m Lser=0.6n Rpar=0.05G
SYMBOL cap -384 1664 R0
SYMATTR InstName C80
SYMATTR Value 10µF
SYMATTR SpiceLine V=50 Rser=2.2m Lser=0.6n Rpar=0.05G
SYMBOL cap -320 1664 R0
SYMATTR InstName C81
SYMATTR Value 10µF
SYMATTR SpiceLine V=50 Rser=2.2m Lser=0.6n Rpar=0.05G
SYMBOL cap -256 1664 R0
SYMATTR InstName C82
SYMATTR Value 10µF
SYMATTR SpiceLine V=50 Rser=2.2m Lser=0.6n Rpar=0.05G
SYMBOL cap -192 1664 R0
SYMATTR InstName C83
SYMATTR Value 10µF
SYMATTR SpiceLine V=50 Rser=2.2m Lser=0.6n Rpar=0.05G
SYMBOL cap -128 1664 R0
SYMATTR InstName C84
SYMATTR Value 10µF
SYMATTR SpiceLine V=50 Rser=2.2m Lser=0.6n Rpar=0.05G
SYMBOL cap -64 1664 R0
SYMATTR InstName C85
SYMATTR Value 10µF
SYMATTR SpiceLine V=50 Rser=2.2m Lser=0.6n Rpar=0.05G
SYMBOL ind 128 1776 R90
WINDOW 0 5 56 VBottom 2
WINDOW 3 32 56 VTop 2
SYMATTR InstName L10
SYMATTR Value 4.7µH
SYMATTR SpiceLine Rser=0.023 Rpar=6.2 Cpar=2.12pF
SYMBOL cap 272 1664 R0
SYMATTR InstName C86
SYMATTR Value 10µF
SYMATTR SpiceLine V=50 Rser=2.2m Lser=0.6n Rpar=0.05G
SYMBOL cap 352 1664 R0
SYMATTR InstName C87
SYMATTR Value 10µF
SYMATTR SpiceLine V=50 Rser=2.2m Lser=0.6n Rpar=0.05G
SYMBOL cap 432 1664 R0
WINDOW 3 24 56 Invisible 2
SYMATTR Value C0805X104J5RAC3316
SYMATTR InstName C88
SYMATTR Prefix X
SYMBOL res -1216 1664 R0
SYMATTR InstName R5
SYMATTR Value 50
SYMBOL PLT10HH9016R0PN -960 2112 R270
SYMATTR InstName U4
SYMBOL voltage -1184 2064 R0
WINDOW 3 -185 101 Left 2
WINDOW 123 -185 129 Left 2
WINDOW 39 0 0 Left 0
SYMATTR Value ""
SYMATTR Value2 AC 1V
SYMATTR InstName V6
SYMBOL cap -752 2016 R0
WINDOW 3 24 56 Invisible 2
SYMATTR Value C0805X102K1RACAUTO
SYMATTR InstName C89
SYMATTR Prefix X
SYMBOL cap -544 2064 R0
WINDOW 3 24 56 Invisible 2
SYMATTR Value C0805X104J5RAC3316
SYMATTR InstName C90
SYMATTR Prefix X
SYMBOL cap -688 2016 R0
WINDOW 3 24 56 Invisible 2
SYMATTR Value C0805X102K1RACAUTO
SYMATTR InstName C91
SYMATTR Prefix X
SYMBOL cap -752 2112 R0
WINDOW 3 24 56 Invisible 2
SYMATTR Value C0805X102K1RACAUTO
SYMATTR InstName C92
SYMATTR Prefix X
SYMBOL cap -688 2112 R0
WINDOW 3 24 56 Invisible 2
SYMATTR Value C0805X102K1RACAUTO
SYMATTR InstName C93
SYMATTR Prefix X
SYMBOL cap -608 2064 R0
WINDOW 3 24 56 Invisible 2
SYMATTR Value C0805X102K1RACAUTO
SYMATTR InstName C94
SYMATTR Prefix X
SYMBOL cap -496 2064 R0
SYMATTR InstName C95
SYMATTR Value 10µF
SYMATTR SpiceLine V=50 Rser=2.2m Lser=0.6n Rpar=0.05G
SYMBOL ind 128 2000 R90
WINDOW 0 5 56 VBottom 2
WINDOW 3 32 56 VTop 2
SYMATTR InstName L11
SYMATTR Value 4.7µH
SYMATTR SpiceLine Rser=0.023 Rpar=6.2 Cpar=2.12pF
SYMBOL cap -432 2064 R0
SYMATTR InstName C96
SYMATTR Value 10µF
SYMATTR SpiceLine V=50 Rser=2.2m Lser=0.6n Rpar=0.05G
SYMBOL cap -368 2064 R0
SYMATTR InstName C97
SYMATTR Value 10µF
SYMATTR SpiceLine V=50 Rser=2.2m Lser=0.6n Rpar=0.05G
SYMBOL cap -304 2064 R0
SYMATTR InstName C98
SYMATTR Value 10µF
SYMATTR SpiceLine V=50 Rser=2.2m Lser=0.6n Rpar=0.05G
SYMBOL cap -240 2064 R0
SYMATTR InstName C99
SYMATTR Value 10µF
SYMATTR SpiceLine V=50 Rser=2.2m Lser=0.6n Rpar=0.05G
SYMBOL cap -176 2064 R0
SYMATTR InstName C100
SYMATTR Value 10µF
SYMATTR SpiceLine V=50 Rser=2.2m Lser=0.6n Rpar=0.05G
SYMBOL cap -112 2064 R0
SYMATTR InstName C101
SYMATTR Value 10µF
SYMATTR SpiceLine V=50 Rser=2.2m Lser=0.6n Rpar=0.05G
SYMBOL cap -48 2064 R0
SYMATTR InstName C102
SYMATTR Value 10µF
SYMATTR SpiceLine V=50 Rser=2.2m Lser=0.6n Rpar=0.05G
SYMBOL ind 144 2176 R90
WINDOW 0 5 56 VBottom 2
WINDOW 3 32 56 VTop 2
SYMATTR InstName L12
SYMATTR Value 4.7µH
SYMATTR SpiceLine Rser=0.023 Rpar=6.2 Cpar=2.12pF
SYMBOL cap 288 2064 R0
SYMATTR InstName C103
SYMATTR Value 10µF
SYMATTR SpiceLine V=50 Rser=2.2m Lser=0.6n Rpar=0.05G
SYMBOL cap 368 2064 R0
SYMATTR InstName C104
SYMATTR Value 10µF
SYMATTR SpiceLine V=50 Rser=2.2m Lser=0.6n Rpar=0.05G
SYMBOL cap 448 2064 R0
WINDOW 3 24 56 Invisible 2
SYMATTR Value C0805X104J5RAC3316
SYMATTR InstName C105
SYMATTR Prefix X
SYMBOL voltage 608 2528 R0
WINDOW 3 -185 101 Left 2
WINDOW 123 39 118 Left 2
WINDOW 39 0 0 Left 0
SYMATTR Value ""
SYMATTR Value2 AC 1V
SYMATTR InstName V7
SYMBOL cap -752 2496 R0
WINDOW 3 24 56 Invisible 2
SYMATTR Value C0805X102K1RACAUTO
SYMATTR InstName C106
SYMATTR Prefix X
SYMBOL cap -544 2544 R0
WINDOW 3 24 56 Invisible 2
SYMATTR Value C0805X104J5RAC3316
SYMATTR InstName C107
SYMATTR Prefix X
SYMBOL cap -688 2496 R0
WINDOW 3 24 56 Invisible 2
SYMATTR Value C0805X102K1RACAUTO
SYMATTR InstName C108
SYMATTR Prefix X
SYMBOL cap -752 2592 R0
WINDOW 3 24 56 Invisible 2
SYMATTR Value C0805X102K1RACAUTO
SYMATTR InstName C109
SYMATTR Prefix X
SYMBOL cap -688 2592 R0
WINDOW 3 24 56 Invisible 2
SYMATTR Value C0805X102K1RACAUTO
SYMATTR InstName C110
SYMATTR Prefix X
SYMBOL cap -608 2544 R0
WINDOW 3 24 56 Invisible 2
SYMATTR Value C0805X102K1RACAUTO
SYMATTR InstName C111
SYMATTR Prefix X
SYMBOL cap -496 2544 R0
SYMATTR InstName C112
SYMATTR Value 10µF
SYMATTR SpiceLine V=50 Rser=2.2m Lser=0.6n Rpar=0.05G
SYMBOL ind 128 2480 R90
WINDOW 0 5 56 VBottom 2
WINDOW 3 32 56 VTop 2
SYMATTR InstName L13
SYMATTR Value 4.7µH
SYMATTR SpiceLine Rser=0.023 Rpar=6.2 Cpar=2.12pF
SYMBOL cap -432 2544 R0
SYMATTR InstName C113
SYMATTR Value 10µF
SYMATTR SpiceLine V=50 Rser=2.2m Lser=0.6n Rpar=0.05G
SYMBOL cap -368 2544 R0
SYMATTR InstName C114
SYMATTR Value 10µF
SYMATTR SpiceLine V=50 Rser=2.2m Lser=0.6n Rpar=0.05G
SYMBOL cap -304 2544 R0
SYMATTR InstName C115
SYMATTR Value 10µF
SYMATTR SpiceLine V=50 Rser=2.2m Lser=0.6n Rpar=0.05G
SYMBOL cap -240 2544 R0
SYMATTR InstName C116
SYMATTR Value 10µF
SYMATTR SpiceLine V=50 Rser=2.2m Lser=0.6n Rpar=0.05G
SYMBOL cap -176 2544 R0
SYMATTR InstName C117
SYMATTR Value 10µF
SYMATTR SpiceLine V=50 Rser=2.2m Lser=0.6n Rpar=0.05G
SYMBOL cap -112 2544 R0
SYMATTR InstName C118
SYMATTR Value 10µF
SYMATTR SpiceLine V=50 Rser=2.2m Lser=0.6n Rpar=0.05G
SYMBOL cap -48 2544 R0
SYMATTR InstName C119
SYMATTR Value 10µF
SYMATTR SpiceLine V=50 Rser=2.2m Lser=0.6n Rpar=0.05G
SYMBOL ind 144 2656 R90
WINDOW 0 5 56 VBottom 2
WINDOW 3 32 56 VTop 2
SYMATTR InstName L14
SYMATTR Value 4.7µH
SYMATTR SpiceLine Rser=0.023 Rpar=6.2 Cpar=2.12pF
SYMBOL cap 288 2544 R0
SYMATTR InstName C120
SYMATTR Value 10µF
SYMATTR SpiceLine V=50 Rser=2.2m Lser=0.6n Rpar=0.05G
SYMBOL cap 368 2544 R0
SYMATTR InstName C121
SYMATTR Value 10µF
SYMATTR SpiceLine V=50 Rser=2.2m Lser=0.6n Rpar=0.05G
SYMBOL cap 448 2544 R0
WINDOW 3 24 56 Invisible 2
SYMATTR Value C0805X104J5RAC3316
SYMATTR InstName C122
SYMATTR Prefix X
SYMBOL res -1200 2544 R0
SYMATTR InstName R6
SYMATTR Value 50
SYMBOL voltage 2784 -32 R0
WINDOW 3 -185 101 Left 2
WINDOW 123 -185 129 Left 2
WINDOW 39 0 0 Left 0
SYMATTR Value ""
SYMATTR Value2 AC 1V
SYMATTR InstName V8
SYMBOL cap 1392 -64 R0
WINDOW 3 24 56 Invisible 2
SYMATTR Value C0805X102K1RACAUTO
SYMATTR InstName C123
SYMATTR Prefix X
SYMBOL cap 1600 -16 R0
WINDOW 3 24 56 Invisible 2
SYMATTR Value C0805X104J5RAC3316
SYMATTR InstName C124
SYMATTR Prefix X
SYMBOL cap 1456 -64 R0
WINDOW 3 24 56 Invisible 2
SYMATTR Value C0805X102K1RACAUTO
SYMATTR InstName C125
SYMATTR Prefix X
SYMBOL cap 1392 32 R0
WINDOW 3 24 56 Invisible 2
SYMATTR Value C0805X102K1RACAUTO
SYMATTR InstName C126
SYMATTR Prefix X
SYMBOL cap 1456 32 R0
WINDOW 3 24 56 Invisible 2
SYMATTR Value C0805X102K1RACAUTO
SYMATTR InstName C127
SYMATTR Prefix X
SYMBOL cap 1536 -16 R0
WINDOW 3 24 56 Invisible 2
SYMATTR Value C0805X102K1RACAUTO
SYMATTR InstName C128
SYMATTR Prefix X
SYMBOL cap 1648 -16 R0
SYMATTR InstName C129
SYMATTR Value 10µF
SYMATTR SpiceLine V=50 Rser=2.2m Lser=0.6n Rpar=0.05G
SYMBOL ind 2272 -80 R90
WINDOW 0 5 56 VBottom 2
WINDOW 3 32 56 VTop 2
SYMATTR InstName L15
SYMATTR Value 4.7µH
SYMATTR SpiceLine Rser=0.023 Rpar=6.2 Cpar=2.12pF
SYMBOL res 2320 -80 R0
SYMATTR InstName R7
SYMATTR Value 0.05
SYMATTR SpiceLine tol=1 pwr=125m
SYMBOL cap 2320 48 R0
SYMATTR InstName C130
SYMATTR Value 330µF
SYMATTR SpiceLine V=50 Irms=600m Rser=230m
SYMBOL cap 1712 -16 R0
SYMATTR InstName C131
SYMATTR Value 10µF
SYMATTR SpiceLine V=50 Rser=2.2m Lser=0.6n Rpar=0.05G
SYMBOL cap 1776 -16 R0
SYMATTR InstName C132
SYMATTR Value 10µF
SYMATTR SpiceLine V=50 Rser=2.2m Lser=0.6n Rpar=0.05G
SYMBOL cap 1840 -16 R0
SYMATTR InstName C133
SYMATTR Value 10µF
SYMATTR SpiceLine V=50 Rser=2.2m Lser=0.6n Rpar=0.05G
SYMBOL cap 1904 -16 R0
SYMATTR InstName C134
SYMATTR Value 10µF
SYMATTR SpiceLine V=50 Rser=2.2m Lser=0.6n Rpar=0.05G
SYMBOL cap 1968 -16 R0
SYMATTR InstName C135
SYMATTR Value 10µF
SYMATTR SpiceLine V=50 Rser=2.2m Lser=0.6n Rpar=0.05G
SYMBOL cap 2032 -16 R0
SYMATTR InstName C136
SYMATTR Value 10µF
SYMATTR SpiceLine V=50 Rser=2.2m Lser=0.6n Rpar=0.05G
SYMBOL cap 2096 -16 R0
SYMATTR InstName C137
SYMATTR Value 10µF
SYMATTR SpiceLine V=50 Rser=2.2m Lser=0.6n Rpar=0.05G
SYMBOL ind 2288 96 R90
WINDOW 0 5 56 VBottom 2
WINDOW 3 32 56 VTop 2
SYMATTR InstName L16
SYMATTR Value 4.7µH
SYMATTR SpiceLine Rser=0.023 Rpar=6.2 Cpar=2.12pF
SYMBOL cap 2432 -16 R0
SYMATTR InstName C138
SYMATTR Value 10µF
SYMATTR SpiceLine V=50 Rser=2.2m Lser=0.6n Rpar=0.05G
SYMBOL cap 2512 -16 R0
SYMATTR InstName C139
SYMATTR Value 10µF
SYMATTR SpiceLine V=50 Rser=2.2m Lser=0.6n Rpar=0.05G
SYMBOL cap 2592 -16 R0
WINDOW 3 24 56 Invisible 2
SYMATTR Value C0805X104J5RAC3316
SYMATTR InstName C140
SYMATTR Prefix X
SYMBOL res 1152 -32 R0
SYMATTR InstName R8
SYMATTR Value 50
TEXT -1368 352 Left 2 !.ac dec 10 10 1G
TEXT -1224 -184 Left 2 !.inc C:\\Users\\KMI3BP\\Documents\\LTspice\\C0805X104J5RAC3316_SPICE.CKT
TEXT -1224 -152 Left 2 !.inc C:\\Users\\KMI3BP\\Documents\\LTspice\\C0805X102K1RACAUTO_SPICE.CKT
TEXT -1224 -128 Left 2 ;.tran 0 10 0 1

The netlist it stands for:
* Draft4.asc
XU1 0 N004 +24V N001 PLT10HH9016R0PN  ; pins 400 499 500 599
V1 +24V 0 AC 1V
XC1 N001 GNDH C0805X102K1RACAUTO  ; pins A B
XC2 N001 N004 C0805X104J5RAC3316  ; pins A B
XC3 N001 GNDH C0805X102K1RACAUTO  ; pins A B
XC4 GNDH N004 C0805X102K1RACAUTO  ; pins A B
XC5 GNDH N004 C0805X102K1RACAUTO  ; pins A B
XC6 N001 N004 C0805X102K1RACAUTO  ; pins A B
C7 N001 N004 10µF V=50 Rser=2.2m Lser=0.6n Rpar=0.05G
L1 V_HIGH N001 4.7µH Rser=0.023 Rpar=6.2 Cpar=2.12pF
R1 V_HIGH N003 20m tol=1 pwr=125m
C8 N003 GND_SEPIC 330µF V=50 Irms=600m Rser=230m
C9 N001 N004 10µF V=50 Rser=2.2m Lser=0.6n Rpar=0.05G
C10 N001 N004 10µF V=50 Rser=2.2m Lser=0.6n Rpar=0.05G
C11 N001 N004 10µF V=50 Rser=2.2m Lser=0.6n Rpar=0.05G
C12 N001 N004 10µF V=50 Rser=2.2m Lser=0.6n Rpar=0.05G
C13 N001 N004 10µF V=50 Rser=2.2m Lser=0.6n Rpar=0.05G
C14 N001 N004 10µF V=50 Rser=2.2m Lser=0.6n Rpar=0.05G
C15 N001 N004 10µF V=50 Rser=2.2m Lser=0.6n Rpar=0.05G
L2 GND_SEPIC N004 4.7µH Rser=0.023 Rpar=6.2 Cpar=2.12pF
C16 V_HIGH GND_SEPIC 10µF V=50 Rser=2.2m Lser=0.6n Rpar=0.05G
C17 V_HIGH GND_SEPIC 10µF V=50 Rser=2.2m Lser=0.6n Rpar=0.05G
XC18 V_HIGH GND_SEPIC C0805X104J5RAC3316  ; pins A B
XU2 0 N007 +24V_1 N005 PLT10HH9016R0PN  ; pins 400 499 500 599
V2 V_HIGH_1 GND_SEPIC_1 AC 1V
XC19 N005 GNDH_1 C0805X102K1RACAUTO  ; pins A B
XC20 N005 N007 C0805X104J5RAC3316  ; pins A B
XC21 N005 GNDH_1 C0805X102K1RACAUTO  ; pins A B
XC22 GNDH_1 N007 C0805X102K1RACAUTO  ; pins A B
XC23 GNDH_1 N007 C0805X102K1RACAUTO  ; pins A B
XC24 N005 N007 C0805X102K1RACAUTO  ; pins A B
C25 N005 N007 10µF V=50 Rser=2.2m Lser=0.6n Rpar=0.05G
L3 V_HIGH_1 N005 4.7µH Rser=0.023 Rpar=6.2 Cpar=2.12pF
R2 V_HIGH_1 N006 20m tol=1 pwr=125m
C26 N006 GND_SEPIC_1 330µF V=50 Irms=600m Rser=230m
C27 N005 N007 10µF V=50 Rser=2.2m Lser=0.6n Rpar=0.05G
C28 N005 N007 10µF V=50 Rser=2.2m Lser=0.6n Rpar=0.05G
C29 N005 N007 10µF V=50 Rser=2.2m Lser=0.6n Rpar=0.05G
C30 N005 N007 10µF V=50 Rser=2.2m Lser=0.6n Rpar=0.05G
C31 N005 N007 10µF V=50 Rser=2.2m Lser=0.6n Rpar=0.05G
C32 N005 N007 10µF V=50 Rser=2.2m Lser=0.6n Rpar=0.05G
C33 N005 N007 10µF V=50 Rser=2.2m Lser=0.6n Rpar=0.05G
L4 GND_SEPIC_1 N007 4.7µH Rser=0.023 Rpar=6.2 Cpar=2.12pF
C34 V_HIGH_1 GND_SEPIC_1 10µF V=50 Rser=2.2m Lser=0.6n Rpar=0.05G
C35 V_HIGH_1 GND_SEPIC_1 10µF V=50 Rser=2.2m Lser=0.6n Rpar=0.05G
XC36 V_HIGH_1 GND_SEPIC_1 C0805X104J5RAC3316  ; pins A B
R3 +24V_1 0 50
V3 +24V_2 0 AC 1V
XC37 +24V_2 GNDH_2 C0805X102K1RACAUTO  ; pins A B
XC38 +24V_2 0 C0805X104J5RAC3316  ; pins A B
XC39 +24V_2 GNDH_2 C0805X102K1RACAUTO  ; pins A B
XC40 GNDH_2 0 C0805X102K1RACAUTO  ; pins A B
XC41 GNDH_2 0 C0805X102K1RACAUTO  ; pins A B
XC42 +24V_2 0 C0805X102K1RACAUTO  ; pins A B
C43 +24V_2 0 10µF V=50 Rser=2.2m Lser=0.6n Rpar=0.05G
L5 V_HIGH_2 +24V_2 4.7µH Rser=0.023 Rpar=6.2 Cpar=2.12pF
R4 V_HIGH_2 N008 0.05 tol=1 pwr=125m
C44 N008 GND_SEPIC_2 330µF V=50 Irms=600m Rser=230m
C45 +24V_2 0 10µF V=50 Rser=2.2m Lser=0.6n Rpar=0.05G
C46 +24V_2 0 10µF V=50 Rser=2.2m Lser=0.6n Rpar=0.05G
C47 +24V_2 0 10µF V=50 Rser=2.2m Lser=0.6n Rpar=0.05G
C48 +24V_2 0 10µF V=50 Rser=2.2m Lser=0.6n Rpar=0.05G
C49 +24V_2 0 10µF V=50 Rser=2.2m Lser=0.6n Rpar=0.05G
C50 +24V_2 0 10µF V=50 Rser=2.2m Lser=0.6n Rpar=0.05G
C51 +24V_2 0 10µF V=50 Rser=2.2m Lser=0.6n Rpar=0.05G
L6 GND_SEPIC_2 0 4.7µH Rser=0.023 Rpar=6.2 Cpar=2.12pF
C52 V_HIGH_2 GND_SEPIC_2 10µF V=50 Rser=2.2m Lser=0.6n Rpar=0.05G
C53 V_HIGH_2 GND_SEPIC_2 10µF V=50 Rser=2.2m Lser=0.6n Rpar=0.05G
XC54 V_HIGH_2 GND_SEPIC_2 C0805X104J5RAC3316  ; pins A B
V4 +24V_3 0 AC 1V
XC55 +24V_3 GNDH_3 C0805X102K1RACAUTO  ; pins A B
XC56 +24V_3 0 C0805X104J5RAC3316  ; pins A B
XC57 +24V_3 GNDH_3 C0805X102K1RACAUTO  ; pins A B
XC58 GNDH_3 0 C0805X102K1RACAUTO  ; pins A B
XC59 GNDH_3 0 C0805X102K1RACAUTO  ; pins A B
XC60 +24V_3 0 C0805X102K1RACAUTO  ; pins A B
C61 +24V_3 0 10µF V=50 Rser=2.2m Lser=0.6n Rpar=0.05G
L7 V_HIGH_3 +24V_3 4.7µH Rser=0.023 Rpar=6.2 Cpar=2.12pF
C62 +24V_3 0 10µF V=50 Rser=2.2m Lser=0.6n Rpar=0.05G
C63 +24V_3 0 10µF V=50 Rser=2.2m Lser=0.6n Rpar=0.05G
C64 +24V_3 0 10µF V=50 Rser=2.2m Lser=0.6n Rpar=0.05G
C65 +24V_3 0 10µF V=50 Rser=2.2m Lser=0.6n Rpar=0.05G
C66 +24V_3 0 10µF V=50 Rser=2.2m Lser=0.6n Rpar=0.05G
C67 +24V_3 0 10µF V=50 Rser=2.2m Lser=0.6n Rpar=0.05G
C68 +24V_3 0 10µF V=50 Rser=2.2m Lser=0.6n Rpar=0.05G
L8 GND_SEPIC_3 0 4.7µH Rser=0.023 Rpar=6.2 Cpar=2.12pF
C69 V_HIGH_3 GND_SEPIC_3 10µF V=50 Rser=2.2m Lser=0.6n Rpar=0.05G
C70 V_HIGH_3 GND_SEPIC_3 10µF V=50 Rser=2.2m Lser=0.6n Rpar=0.05G
XC71 V_HIGH_3 GND_SEPIC_3 C0805X104J5RAC3316  ; pins A B
XU3 0 N010 +24V_4 N009 PLT10HH9016R0PN  ; pins 400 499 500 599
V5 V_HIGH_4 GND_SEPIC_4 AC 1V
XC72 N009 GNDH_4 C0805X102K1RACAUTO  ; pins A B
XC73 N009 N010 C0805X104J5RAC3316  ; pins A B
XC74 N009 GNDH_4 C0805X102K1RACAUTO  ; pins A B
XC75 GNDH_4 N010 C0805X102K1RACAUTO  ; pins A B
XC76 GNDH_4 N010 C0805X102K1RACAUTO  ; pins A B
XC77 N009 N010 C0805X102K1RACAUTO  ; pins A B
C78 N009 N010 10µF V=50 Rser=2.2m Lser=0.6n Rpar=0.05G
L9 V_HIGH_4 N009 4.7µH Rser=0.023 Rpar=6.2 Cpar=2.12pF
C79 N009 N010 10µF V=50 Rser=2.2m Lser=0.6n Rpar=0.05G
C80 N009 N010 10µF V=50 Rser=2.2m Lser=0.6n Rpar=0.05G
C81 N009 N010 10µF V=50 Rser=2.2m Lser=0.6n Rpar=0.05G
C82 N009 N010 10µF V=50 Rser=2.2m Lser=0.6n Rpar=0.05G
C83 N009 N010 10µF V=50 Rser=2.2m Lser=0.6n Rpar=0.05G
C84 N009 N010 10µF V=50 Rser=2.2m Lser=0.6n Rpar=0.05G
C85 N009 N010 10µF V=50 Rser=2.2m Lser=0.6n Rpar=0.05G
L10 GND_SEPIC_4 N010 4.7µH Rser=0.023 Rpar=6.2 Cpar=2.12pF
C86 V_HIGH_4 GND_SEPIC_4 10µF V=50 Rser=2.2m Lser=0.6n Rpar=0.05G
C87 V_HIGH_4 GND_SEPIC_4 10µF V=50 Rser=2.2m Lser=0.6n Rpar=0.05G
XC88 V_HIGH_4 GND_SEPIC_4 C0805X104J5RAC3316  ; pins A B
R5 +24V_4 0 50
XU4 0 N012 +24V_5 N011 PLT10HH9016R0PN  ; pins 400 499 500 599
V6 +24V_5 0 AC 1V
XC89 N011 GNDH_5 C0805X102K1RACAUTO  ; pins A B
XC90 N011 N012 C0805X104J5RAC3316  ; pins A B
XC91 N011 GNDH_5 C0805X102K1RACAUTO  ; pins A B
XC92 GNDH_5 N012 C0805X102K1RACAUTO  ; pins A B
XC93 GNDH_5 N012 C0805X102K1RACAUTO  ; pins A B
XC94 N011 N012 C0805X102K1RACAUTO  ; pins A B
C95 N011 N012 10µF V=50 Rser=2.2m Lser=0.6n Rpar=0.05G
L11 V_HIGH_5 N011 4.7µH Rser=0.023 Rpar=6.2 Cpar=2.12pF
C96 N011 N012 10µF V=50 Rser=2.2m Lser=0.6n Rpar=0.05G
C97 N011 N012 10µF V=50 Rser=2.2m Lser=0.6n Rpar=0.05G
C98 N011 N012 10µF V=50 Rser=2.2m Lser=0.6n Rpar=0.05G
C99 N011 N012 10µF V=50 Rser=2.2m Lser=0.6n Rpar=0.05G
C100 N011 N012 10µF V=50 Rser=2.2m Lser=0.6n Rpar=0.05G
C101 N011 N012 10µF V=50 Rser=2.2m Lser=0.6n Rpar=0.05G
C102 N011 N012 10µF V=50 Rser=2.2m Lser=0.6n Rpar=0.05G
L12 GND_SEPIC_5 N012 4.7µH Rser=0.023 Rpar=6.2 Cpar=2.12pF
C103 V_HIGH_5 GND_SEPIC_5 10µF V=50 Rser=2.2m Lser=0.6n Rpar=0.05G
C104 V_HIGH_5 GND_SEPIC_5 10µF V=50 Rser=2.2m Lser=0.6n Rpar=0.05G
XC105 V_HIGH_5 GND_SEPIC_5 C0805X104J5RAC3316  ; pins A B
V7 V_HIGH_6 GND_SEPIC_4 AC 1V
XC106 +24V_6 GNDH_6 C0805X102K1RACAUTO  ; pins A B
XC107 +24V_6 0 C0805X104J5RAC3316  ; pins A B
XC108 +24V_6 GNDH_6 C0805X102K1RACAUTO  ; pins A B
XC109 GNDH_6 0 C0805X102K1RACAUTO  ; pins A B
XC110 GNDH_6 0 C0805X102K1RACAUTO  ; pins A B
XC111 +24V_6 0 C0805X102K1RACAUTO  ; pins A B
C112 +24V_6 0 10µF V=50 Rser=2.2m Lser=0.6n Rpar=0.05G
L13 V_HIGH_6 +24V_6 4.7µH Rser=0.023 Rpar=6.2 Cpar=2.12pF
C113 +24V_6 0 10µF V=50 Rser=2.2m Lser=0.6n Rpar=0.05G
C114 +24V_6 0 10µF V=50 Rser=2.2m Lser=0.6n Rpar=0.05G
C115 +24V_6 0 10µF V=50 Rser=2.2m Lser=0.6n Rpar=0.05G
C116 +24V_6 0 10µF V=50 Rser=2.2m Lser=0.6n Rpar=0.05G
C117 +24V_6 0 10µF V=50 Rser=2.2m Lser=0.6n Rpar=0.05G
C118 +24V_6 0 10µF V=50 Rser=2.2m Lser=0.6n Rpar=0.05G
C119 +24V_6 0 10µF V=50 Rser=2.2m Lser=0.6n Rpar=0.05G
L14 GND_SEPIC_4 0 4.7µH Rser=0.023 Rpar=6.2 Cpar=2.12pF
C120 V_HIGH_6 GND_SEPIC_4 10µF V=50 Rser=2.2m Lser=0.6n Rpar=0.05G
C121 V_HIGH_6 GND_SEPIC_4 10µF V=50 Rser=2.2m Lser=0.6n Rpar=0.05G
XC122 V_HIGH_6 GND_SEPIC_4 C0805X104J5RAC3316  ; pins A B
R6 +24V_6 0 50
V8 V_HIGH_7 GND_SEPIC_7 AC 1V
XC123 +24V_7 GNDH_7 C0805X102K1RACAUTO  ; pins A B
XC124 +24V_7 0 C0805X104J5RAC3316  ; pins A B
XC125 +24V_7 GNDH_7 C0805X102K1RACAUTO  ; pins A B
XC126 GNDH_7 0 C0805X102K1RACAUTO  ; pins A B
XC127 GNDH_7 0 C0805X102K1RACAUTO  ; pins A B
XC128 +24V_7 0 C0805X102K1RACAUTO  ; pins A B
C129 +24V_7 0 10µF V=50 Rser=2.2m Lser=0.6n Rpar=0.05G
L15 V_HIGH_7 +24V_7 4.7µH Rser=0.023 Rpar=6.2 Cpar=2.12pF
R7 V_HIGH_7 N002 0.05 tol=1 pwr=125m
C130 N002 GND_SEPIC_7 330µF V=50 Irms=600m Rser=230m
C131 +24V_7 0 10µF V=50 Rser=2.2m Lser=0.6n Rpar=0.05G
C132 +24V_7 0 10µF V=50 Rser=2.2m Lser=0.6n Rpar=0.05G
C133 +24V_7 0 10µF V=50 Rser=2.2m Lser=0.6n Rpar=0.05G
C134 +24V_7 0 10µF V=50 Rser=2.2m Lser=0.6n Rpar=0.05G
C135 +24V_7 0 10µF V=50 Rser=2.2m Lser=0.6n Rpar=0.05G
C136 +24V_7 0 10µF V=50 Rser=2.2m Lser=0.6n Rpar=0.05G
C137 +24V_7 0 10µF V=50 Rser=2.2m Lser=0.6n Rpar=0.05G
L16 GND_SEPIC_7 0 4.7µH Rser=0.023 Rpar=6.2 Cpar=2.12pF
C138 V_HIGH_7 GND_SEPIC_7 10µF V=50 Rser=2.2m Lser=0.6n Rpar=0.05G
C139 V_HIGH_7 GND_SEPIC_7 10µF V=50 Rser=2.2m Lser=0.6n Rpar=0.05G
XC140 V_HIGH_7 GND_SEPIC_7 C0805X104J5RAC3316  ; pins A B
R8 +24V_7 0 50
.ac dec 10 10 1G
.inc C:\Users\KMI3BP\Documents\LTspice\C0805X104J5RAC3316_SPICE.CKT
.inc C:\Users\KMI3BP\Documents\LTspice\C0805X102K1RACAUTO_SPICE.CKT
* .tran 0 10 0 1
.lib C:\Users\KMI3BP\Downloads\PLT10HH9016R0PN.mod
.backanno
.end